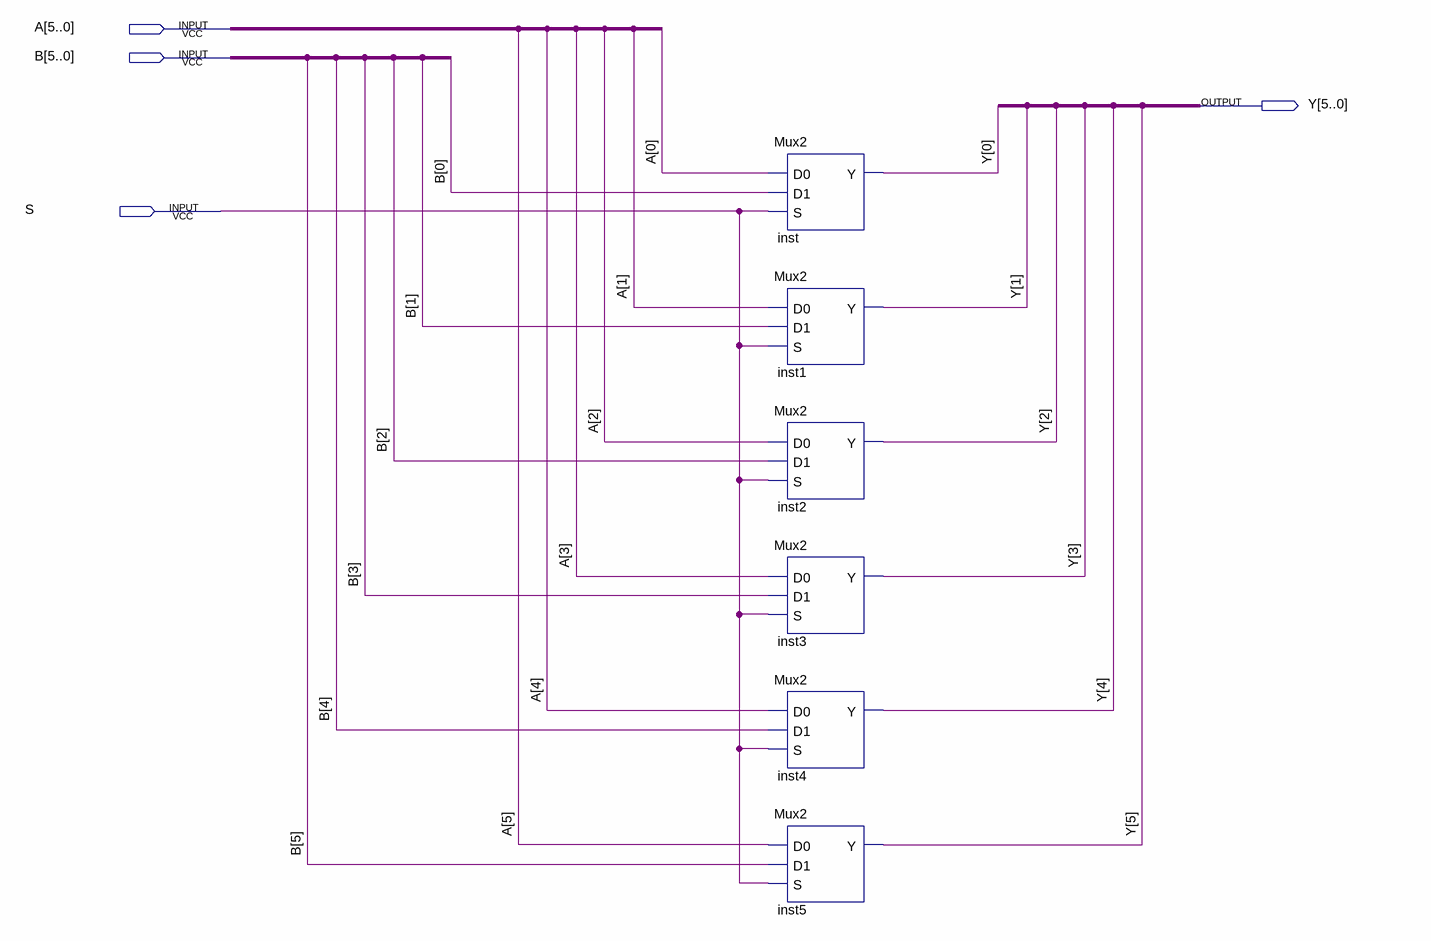
[diagram p0: schematic sheet]
// Quartus schematic Mux2_6bit.bdf as structural Verilog: 6 symbols, 4 pins
module Mux2_6bit (
  input  [5:0] A,
  input  [5:0] B,
  input  S,
  output [5:0] Y
);

  Mux2 inst (.D0(A[0]), .D1(B[0]), .S(S), .Y(Y[0]));
  Mux2 inst1 (.D0(A[1]), .D1(B[1]), .S(S), .Y(Y[1]));
  Mux2 inst2 (.D0(A[2]), .D1(B[2]), .S(S), .Y(Y[2]));
  Mux2 inst3 (.D0(A[3]), .D1(B[3]), .S(S), .Y(Y[3]));
  Mux2 inst4 (.D0(A[4]), .D1(B[4]), .S(S), .Y(Y[4]));
  Mux2 inst5 (.D0(A[5]), .D1(B[5]), .S(S), .Y(Y[5]));
endmodule
